# Altium schematic sheet ESP32.SchDoc
size A4; SheetNumber: 1; SheetTotal: 2
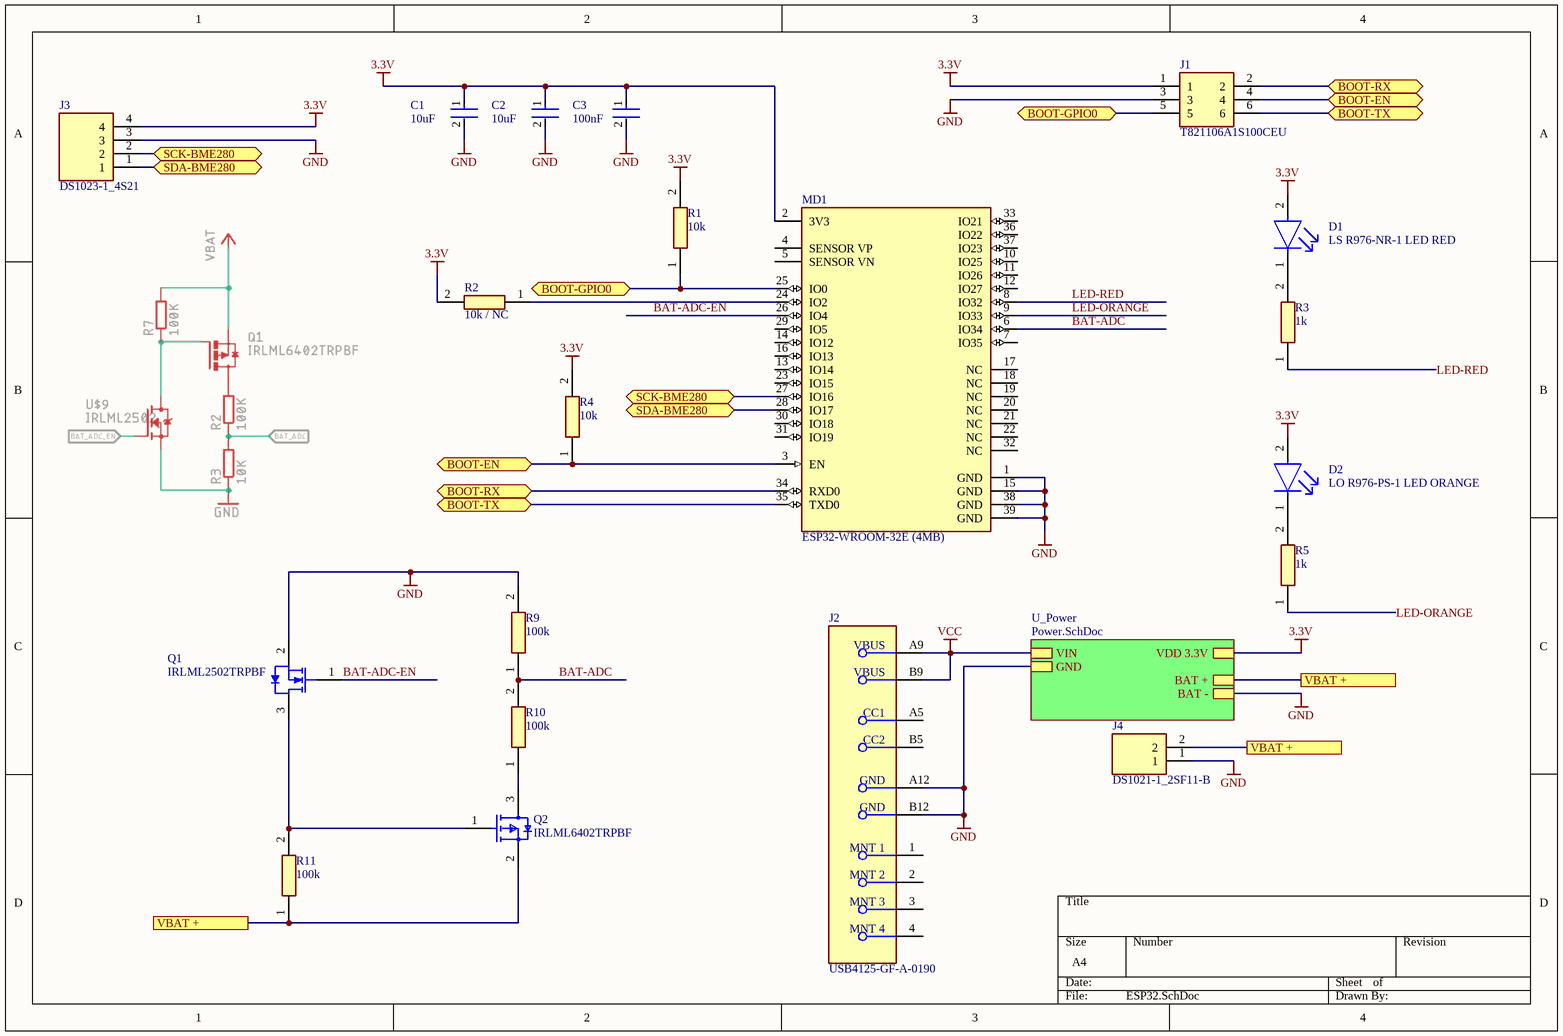
[diagram p0: ESP32.SchDoc]

## Parts
C1  10uF  [FP-0805-L_2_01_0_2-W_1_25-IPC_B]
C2  10uF  [FP-0805-L_2_01_0_2-W_1_25-IPC_B]
C3  100nF  [FP-0805-L_2_01_0_2-W_1_25-IPC_B]
D1  LS R976-NR-1 LED RED  [FP-LS_R976-MFG]
D2  LO R976-PS-1 LED ORANGE  [FP-LO_R976-MFG]
J1  T821106A1S100CEU  [SHDR6W64P254X254_2X3_1524X895X915P]
J2  USB4125-GF-A-0190  [FP-USB4125-GF-A-0190-MFG]
J3  DS1023-1_4S21  [RHDR4W60P0X254_1X4_1016X250X840P]
J4  DS1021-1_2SF11-B  [HDRV2W64P0X254_1X2_508X254X588P]
MD1  ESP32-WROOM-32E (4MB)  [FP-ESP32-WROOM-32E_4MB-MFG]
Q1  IRLML2502TRPBF  [INTR-SOT-23-3_V]
Q2  IRLML6402TRPBF  [FP-Micro3-MFG]
R1  10k  [RESC2013X65N]
R2  10k / NC  [RESC2013X65N]
R3  1k  [RESC2013X65N]
R4  10k  [RESC2013X65N]
R5  1k  [RESC2013X65N]
R9  100k  [RESC2013X65N]
R10  100k  [RESC2013X65N]
R11  100k  [RESC2013X65N]

## Sub-sheets
U_Power = Power.SchDoc: VDD 3.3V, VIN, GND, BAT +, BAT -

## Ports
BOOT-EN (bidir), BOOT-GPIO0 (bidir), BOOT-RX (bidir), BOOT-TX (bidir), SCK-BME280 (bidir), SDA-BME280 (bidir), VBAT +

## Nets
3.3V: C1.1 C2.1 C3.1 D1.2(A) D2.2(A) J1.1 J3.4 MD1.2(3V3) R1.2 R2.2 R4.2 ; sheet U_Power/VDD 3.3V
GND: C1.2 C2.2 C3.2 J1.3 J2.A12(GND) J2.B12(GND) J3.3 J4.1 MD1.1(GND) MD1.15(GND) MD1.38(GND) MD1.39(GND) Q1.2(S) R9.2 ; sheet U_Power/GND, sheet U_Power/BAT -
VCC: J2.A9(VBUS) J2.B9(VBUS) ; sheet U_Power/VIN
BAT-ADC: MD1.6(IO34) R9.1 R10.2
BAT-ADC-EN: MD1.26(IO4) Q1.1(G)
BOOT-EN: J1.4 MD1.3(EN) R4.1 ; port BOOT-EN
BOOT-GPIO0: J1.5 MD1.25(IO0) R1.1 ; port BOOT-GPIO0
BOOT-RX: J1.2 MD1.34(RXD0) ; port BOOT-RX
BOOT-TX: J1.6 MD1.35(TXD0) ; port BOOT-TX
LED-ORANGE: MD1.9(IO33) R5.1
LED-RED: MD1.8(IO32) R3.1
SCK-BME280: J3.2 MD1.27(IO16) ; port SCK-BME280
SDA-BME280: J3.1 MD1.28(IO17) ; port SDA-BME280
VBAT +: J4.2 Q2.2(S) R11.1 ; port VBAT +, sheet U_Power/BAT +
NetD1_1: D1.1(C) R3.2
NetD2_1: D2.1(C) R5.2
NetMD1_24: MD1.24(IO2) R2.1
NetQ1_3: Q1.3(D) Q2.1(G) R11.2
NetQ2_3: Q2.3(D) R10.1

Not connected (* = marked no-connect by the designer): J2 1(MNT_1) 2(MNT_2) 3(MNT_3) 4(MNT_4) A5(CC1) B5(CC2); MD1 4(SENSOR_VP) 5(SENSOR_VN) 7(IO35) 10(IO25) 11(IO26) 12(IO27) 13(IO14) 14(IO12) 16(IO13) 17(NC) 18(NC) 19(NC) 20(NC) 21(NC) 22(NC) 23(IO15) 29(IO5) 30(IO18) 31(IO19) 32(NC) 33(IO21) 36(IO22) 37(IO23)

## Library data of the parts
C1-C3 = CMP-04427-003009-1: Automotive Ceramic Capacitor, 0805, 22nF, 5%, X7R, 15%, 100V; Dissipation Factor: 2.5%; Series: -; Height: 0.94mm; Lead Free: Lead Free; Length: 2.01mm; Max Operating Temperature: 125°C; Number of Pins: 2; Depth: 1.25mm; Thickness: 0.037inch; Mount: Surface Mount; Min Operating Temperature: -55°C; Case/Package: 0805; RoHS Compliant: Yes; Package Quantity: 4000; Capacitance: 22nF; Ratings: AEC-Q200; Dielectric: X7R; Construction: Flat; Tolerance: 5%; Width: 0.049inch; Termination: SMD/SMT; Packaging: Tape and Reel; Voltage Rating: 100V; Case Code (Metric): 2012; Radiation Hardening: No; Case Code (Imperial): 0805; Voltage Rating (DC): 100V
D1 = CMP-62016-000037-1: LED RED DIFFUSED 0805 SMD; Lens Size: 1.25mm; Number of LEDs: 1; Luminous Intensity: 180mcd; Dominant Wavelength: 633nm; Lens Style: Flat; Reverse Voltage: 12V; Lens Color: White; Forward Voltage: 2.5V; Forward Current: 25mA; Power Dissipation: 65W; Luminous Flux: 0.47lm; Test Current: 20mA; Viewing Angle: 160°; Length: 2mm; Number of Pins: 2; Lens Transparency: Diffused; Min Operating Temperature: -30°C; Case Code (Metric): 2012; Depth: 1.35mm; Color: Red; Illumination Color: Red; Max Operating Temperature: 85°C; Mount: Surface Mount; Case/Package: 0805; Height: 0.9mm; Package Quantity: 16000; Number of Elements: 1; Radiation Hardening: No; Case Code (Imperial): 0805; Packaging: Tape and Reel; Width: 1.25mm
D2 = CMP-62016-000030-1: LED ORANGE DIFFUSED 0805 SMD; Forward Current: 25mA; Number of LEDs: 1; Test Current: 20mA; Viewing Angle: 160°; Reverse Voltage: 12V; Lens Style: Flat; Lens Color: White; Luminous Intensity: 162.5mcd; Dominant Wavelength: 606nm; Lens Size: 1.25mm; Forward Voltage: 2V; Luminous Flux: 0.735lm; Number of Pins: 2; Min Operating Temperature: -30°C; Package Quantity: 16000; Illumination Color: Orange; Color: Orange; Max Operating Temperature: 85°C; Packaging: Tape and Reel; Contact Plating: Tin; Case Code (Metric): 2012; Height: 0.9mm; Radiation Hardening: No; Mount: Surface Mount; Width: 1.25mm; Case Code (Imperial): 0805; Case/Package: 0805; Lens Transparency: Diffused; Length: 2mm
J1 = T821106A1S100CEU: Connector; Manufacturer_Name: Amphenol; Height: 9.15mm; Manufacturer_Part_Number: T821106A1S100CEU; Mouser Part Number: N/A; Mouser Price/Stock: https://www.mouser.co.uk/ProductDetail/Amphenol/T821106A1S100CEU?qs=%252BRAvXJslkuCjsmzKMnqFCQ%3D%3D; Arrow Part Number: T821106A1S100CEU; Arrow Price/Stock: https://www.arrow.com/en/products/t821106a1s100ceu/amphenol?region=europe
J2 = CMP-245163-000004-1: CONN RCPT TYPE C 6P SMD RA
J3 = DS1023-1_4S21: Connector; Manufacturer_Name: Connfly; Manufacturer_Part_Number: DS1023-1*4S21; Datasheet Link: https://www.tme.eu/Document/951e887d7e645db1a4e49e0834499c9b/zl262-sg.pdf; Height: 8.4mm
J4 = DS1021-1_2SF11-B: Connector; Manufacturer_Name: Connfly; Manufacturer_Part_Number: DS1021-1*2SF11-B; Datasheet Link: https://www.tme.com/Document/cc301e58a5da78cb543a94b5a5b7f06a/DS1021.pdf; Height: 5.88mm
MD1 = CMP-194065-000026-1: RX TXRX MOD WIFI TRACE ANT SMD
Q1 = CMP-2000-04985-1: N-Channel HEXFET(R) Power MOSFET, 20 V VDS, +/- 12 V VGS, 4.2 A, 3-Pin SOT23, RoHS, Tape and Reel; Manufacturer: International Rectifier; Drain-to-Source Voltage [Vdss]: 20V; Drain-Source On Resistance-Max: 0.045O; Qg Gate Charge: 8nC; Rated Power Dissipation: 1.25W; Package Reference: SOT-23-3; Manufacturer URL: http://internationalrectifier.com/; Package Description: 3-Pin Small Outline Transistor, Body 2.92 x 1.3 mm, Pitch 0.95 mm; Datasheet Version: Apr-14; Channel Type: N-Channel; Datasheet URL: https://datasheet.ciiva.com/6383/irlml2502pbf-6383216.pdf
Q2 = CMP-32901-000130-1: MOSFET P-CH 20V 3.7A SOT-23; Manufacturer: Infineon; Reverse Recovery Time: 29ns; Max Forward Diode Voltage: -1.2V; Input Capacitace At Vds: 633pF @ -10V; Drain To Source Resistance: 0.05Ω; Gate To Source Voltage: 12V; Max Junction Temp: +150°C; Pulse Drain Current: -22A; Threshold Vgs Min: -0.4V; Turn Off Delay Time: 588ns; Number Of Channels: 1; Power Dissipation: 1.3W; Turn On Delay Time: 350ns; Drain To Source Breakdown Voltage: -20V; Continuous Drain Current: -3.7A; Depletion Mode: False; Gate Charge At Vgs: 8nC @ -5V; Rthja Max: 75°C/W; Threshold Vgs: -0.55V; Standoff Height: 0.01mm; Reverse Recovery Charge: 11nC; Device Class L2: Transistors; Ipc Land Pattern Name: SOT95P237X100-3; Temperature Range High: +150°C; Octopart: https://octopart.com/irlml6402trpbf-infineon-65874989; ComponentLink2URL: https://www.infineon.com/dgdl/irlml6402pbf.pdf?fileId=5546d462533600a401535668d5c2263c; Automotive: No; Manufacturer Part Number: IRLML6402TRPBF; Height: 1.12mm; Drain To Source Voltage: -20V; Digikey Description: MOSFET P-CH 20V 3.7A SOT-23; Device Class L1: Discrete Semiconductors; Package: Micro3; Lead Free: Yes; Temperature Range Low: -55°C; Number Of P Channels: 1; Technology: MOSFET; Temperature: -55°C to +150°C; Category: Trans; Footprint Url: http://irf.com/package/outline/po_micro3.pdf; RoHS: TRUE; Device Class L3: MOSFETs; Threshold Vgs Max: -1.2V; ComponentLink2Description: Datasheet
R1-R5 R9-R11 = 0805W8F1000T5E: Resistor; Manufacturer_Name: UNI-ROYAL(Uniroyal Elec); Datasheet Link: https://datasheet.lcsc.com/szlcsc/Uniroyal-Elec-0805W8F1000T5E_C17408.pdf; Height: 0.65mm; Manufacturer_Part_Number: 0805W8F1000T5E